# EAGLE design OSPLv2_4_12 (EAGLE 6.5.0)
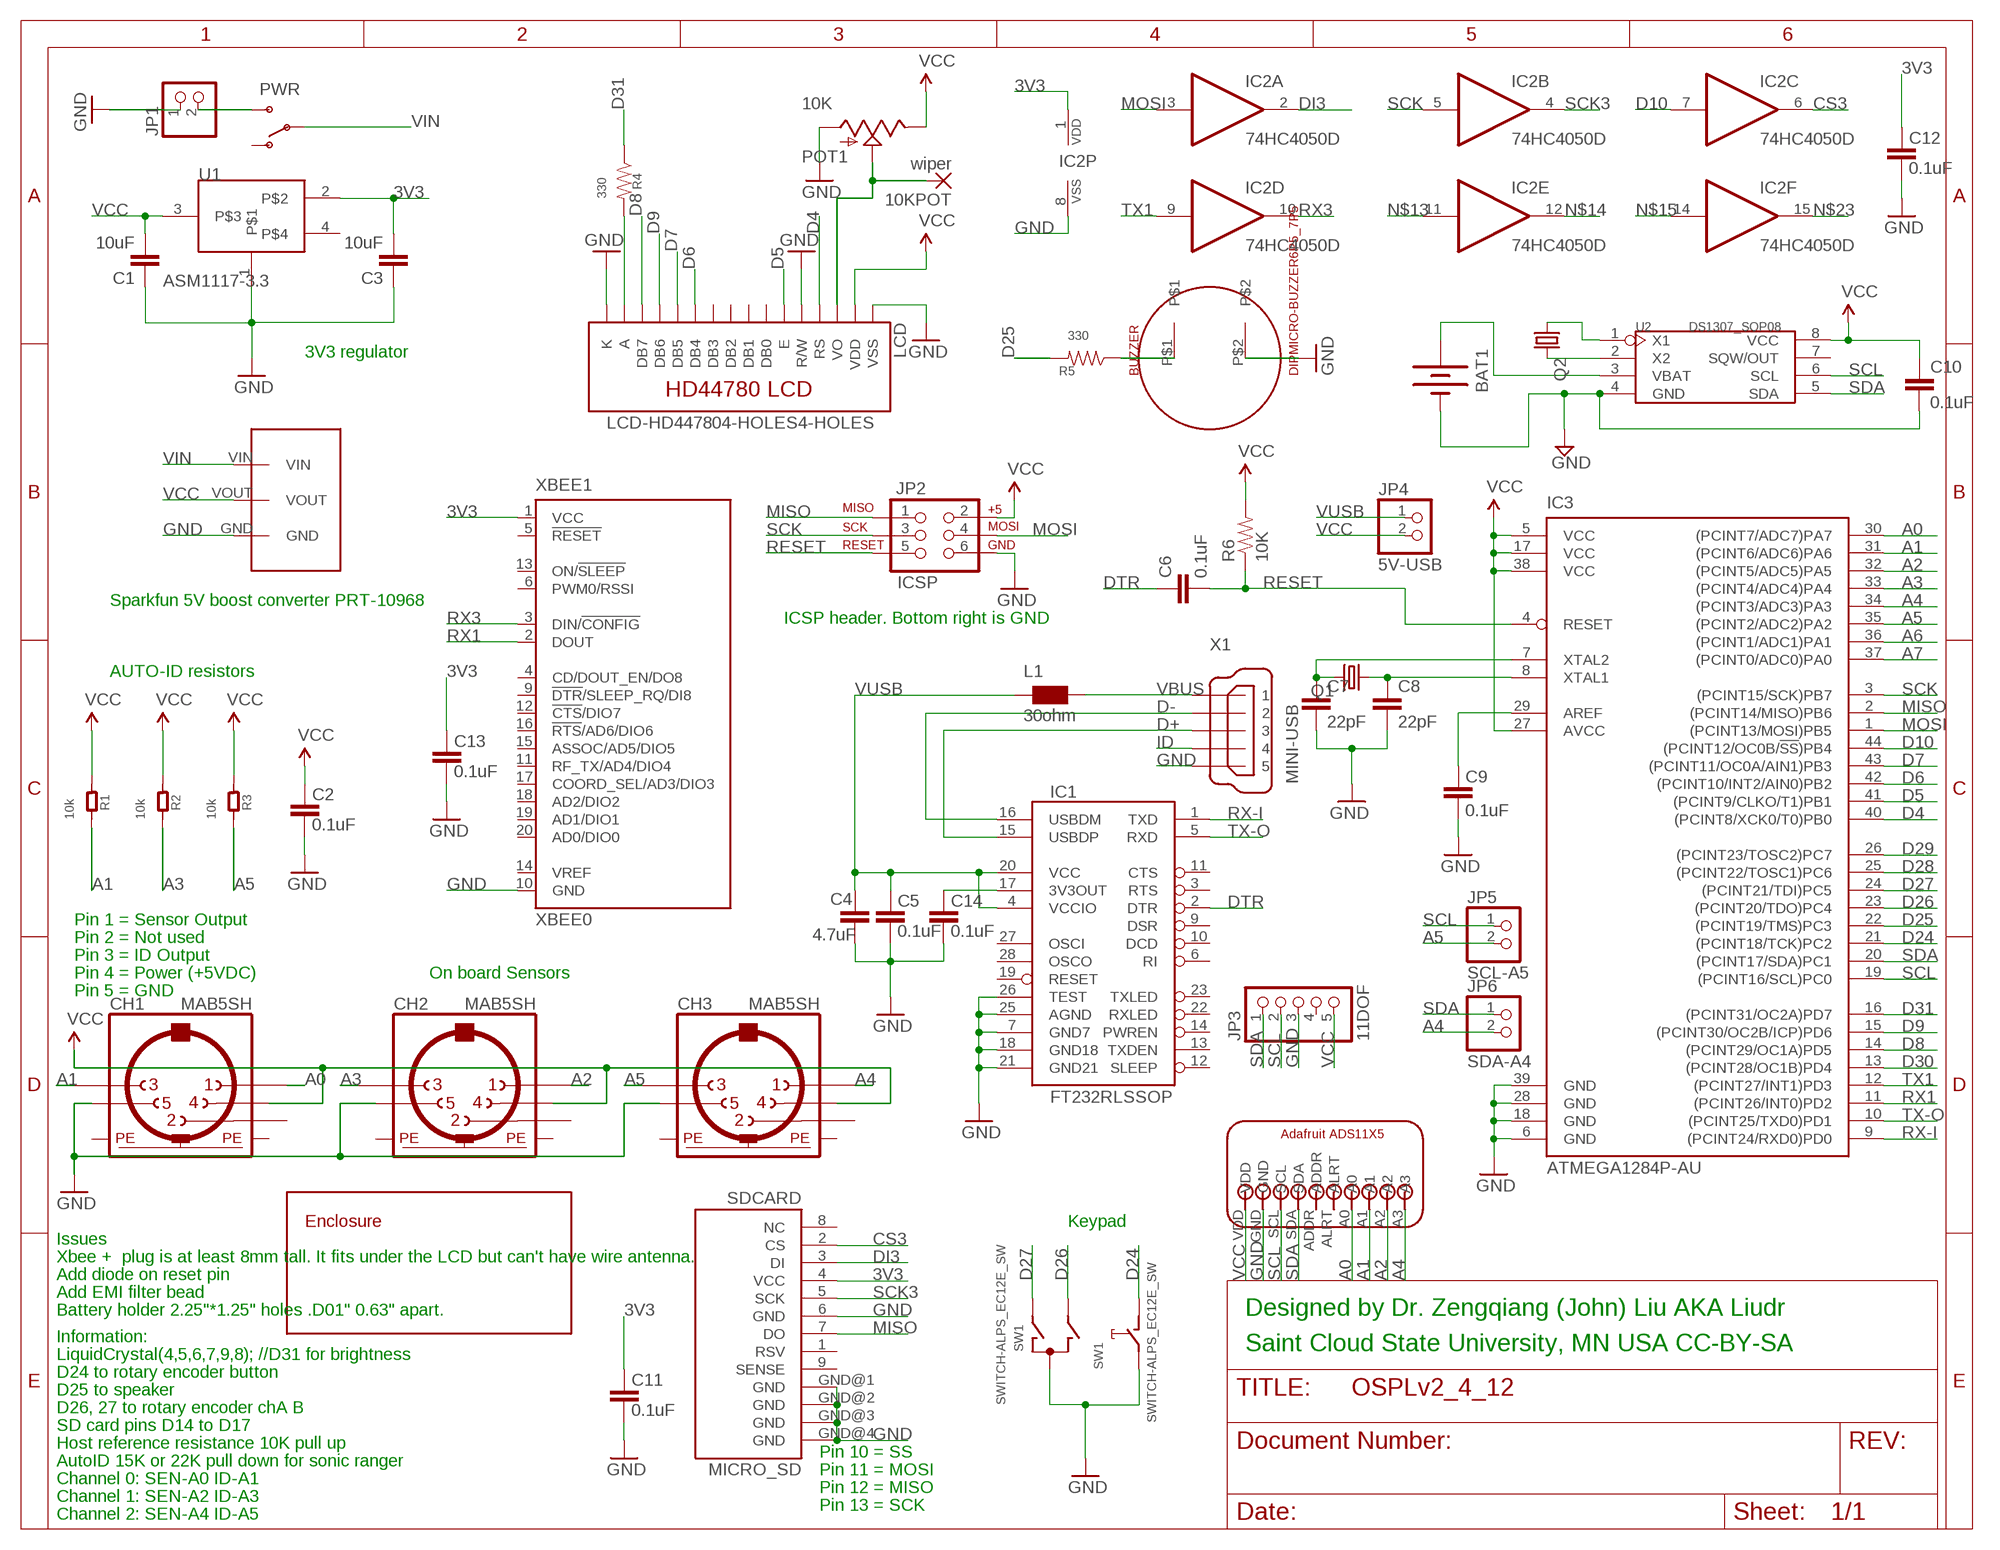
[diagram p0: schematic, sheet 1]

## Parts
10KPOT  wiper  1,6/0,9  [1,6/0,9]
BAT1  BATTERYHARWIN12MMHOLDER  [HARWIN12MMHOLDER]
BUZZER  DIPMICRO-BUZZER6P5_7P5  [BUZZER-6P5-7P5]
C1  10uF  CAP0603-CAP  [0603-CAP]
C2  0.1uF  CAP0603-CAP  [0603-CAP]
C3  10uF  CAP0603-CAP  [0603-CAP]
C4  4.7uF  CAP0603-CAP  [0603-CAP]
C5  0.1uF  CAP0603-CAP  [0603-CAP]
C6  0.1uF  CAP0603-CAP  [0603-CAP]
C7  22pF  CAP0603-CAP  [0603-CAP]
C8  22pF  CAP0603-CAP  [0603-CAP]
C9  0.1uF  CAP0603-CAP  [0603-CAP]
C10  0.1uF  CAP0603-CAP  [0603-CAP]
C11  0.1uF  CAP0603-CAP  [0603-CAP]
C12  0.1uF  CAP0603-CAP  [0603-CAP]
C13  0.1uF  CAP0603-CAP  [0603-CAP]
C14  0.1uF  CAP0603-CAP  [0603-CAP]
CH1  MAB5SH  [MAB5SH]
CH2  MAB5SH  [MAB5SH]
CH3  MAB5SH  [MAB5SH]
IC1  FT232RLSSOP  [SSOP28DB]
IC2  74HC4050D  4050D  [SO16]
IC3  ATMEGA1284P-AU  ATMEGA644A  [TQFP44]
JP1  PINHD-1X2SMALL-PADS  [1X02-BIG]
JP2  ICSP  AVR_SPI_PRG_6PTH  [2X3]
JP3  11DOF  PINHD-1X5  [1X05]
JP4  5V-USB  PINHD-1X2SMALL-PADS  [1X02-BIG]
JP5  SCL-A5  PINHD-1X2SMALL-PADS  [1X02-BIG]
JP6  SDA-A4  PINHD-1X2SMALL-PADS  [1X02-BIG]
L1  30ohm  WE-CBF_0805  [0805]
LCD  LCD-HD447804-HOLES4-HOLES  LCD-HD4478016X2-0-HOLES-NO-FRAME  [LCD-16X2-0HOLES-NO-FRAME]
POT1  10K  POT100K_3362U  [3362U]
PWR  SWITCH-SPSTPTH  [SWITCH-SPDT]
Q1  CRYSTALHC49UP  [HC49UP]
Q2  CRYSTALTC26H  [TC26H]
R1  10k  R-0603  [R0603]
R2  10k  R-0603  [R0603]
R3  10k  R-0603  [R0603]
R4  330  RESISTOR0603-RES  [0603-RES]
R5  330  RESISTOR0603-RES  [0603-RES]
R6  10K  RESISTOR0603-RES  [0603-RES]
SDCARD  MICRO_SD  MICROSD_PP  [MICROSD_PP]
SPEDC-DC  DC-DCBOOSTSPE-DC-DCBOOSTSPE-DC-DC-BOOST  [SPE-DC-DC-BOOST]
SW1  SWITCH-ALPS_EC12E_SW  [SWITCH-ALPS_ALPS_EC12E_SW]
U1  ASM1117-3.3  [SOT223]
U2  DS1307_SOP08  [SOP08]
U$1  ENCLOSUREAG-54  [BUSHING-AG-54]
U$2  ADAFRUIT-ADCADS11X5ADS11X5  [ADAFRUIT-ADC]
X1  MINI-USB  MINI-USB-32005-301  [32005-301]
XBEE1  XBEE0  XBEE-PRO  [XBEE-PRO]

## Nets
3V3 [power]: C3.2 C11.2 C12.2 C13.2 IC2.1(P:VDD) SDCARD.4(VCC) U1.2 XBEE1.1(VCC)
A0: CH1.1 IC3.30((PCINT7/ADC7)PA7) U$2.A0
A1: CH1.3 IC3.31((PCINT6/ADC6)PA6) R1.2 U$2.A1
A2: CH2.1 IC3.32((PCINT5/ADC5)PA5) U$2.A2
A3: CH2.3 IC3.33((PCINT4/ADC4)PA4) R2.2
A4: CH3.1 IC3.34((PCINT3/ADC3)PA3) JP6.2 U$2.A3
A5: CH3.3 IC3.35((PCINT2/ADC2)PA2) JP5.2 R3.2
A6: IC3.36((PCINT1/ADC1)PA1)
A7: IC3.37((PCINT0/ADC0)PA0)
AREF1: C9.2 IC3.29(AREF)
CS3: IC2.6(C:O) SDCARD.2(CS)
D4: IC3.40((PCINT8/XCK0/T0)PB0) LCD.RS
D5: IC3.41((PCINT9/CLKO/T1)PB1) LCD.E
D6: IC3.42((PCINT10/INT2/AIN0)PB2) LCD.DB4
D7: IC3.43((PCINT11/OC0A/AIN1)PB3) LCD.DB5
D8: IC3.14((PCINT29/OC1A)PD5) LCD.DB7
D9: IC3.15((PCINT30/OC2B/ICP)PD6) LCD.DB6
D10: IC2.7(C:I) IC3.44((PCINT12/OC0B/!SS!)PB4)
D24: IC3.21((PCINT18/TCK)PC2) SW1.D
D25: IC3.22((PCINT19/TMS)PC3) R5.2
D26: IC3.23((PCINT20/TDO)PC4) SW1.B
D27: IC3.24((PCINT21/TDI)PC5) SW1.A
D28: IC3.25((PCINT22/TOSC1)PC6)
D29: IC3.26((PCINT23/TOSC2)PC7)
D30: IC3.13((PCINT28/OC1B)PD4)
D31: IC3.16((PCINT31/OC2A)PD7) R4.1
D+: IC1.15(USBDP) X1.3
D-: IC1.16(USBDM) X1.2
DI3: IC2.2(A:O) SDCARD.3(DI)
DTR: C6.1 IC1.2(DTR)
GND [power]: BAT1.PADGND(-) BUZZER.P$2 C1.1 C2.1 C3.1 C4.2 C5.1 C7.2 C8.2 C9.1 C10.2 C11.1 C12.1 C13.1 C14.1 CH1.5 CH2.5 CH3.5 IC1.7(GND7) IC1.18(GND18) IC1.21(GND21) IC1.25(AGND) IC1.26(TEST) IC2.8(P:VSS) IC3.6(GND) IC3.18(GND) IC3.28(GND) IC3.39(GND) JP1.1 JP2.6 JP3.3 LCD.K LCD.R/W LCD.VSS POT1.P$3(A) SDCARD.6(GND) SDCARD.GND@1(GND) SDCARD.GND@2(GND) SDCARD.GND@3(GND) SDCARD.GND@4(GND) SPEDC-DC.GND SW1.C SW1.E U1.1 U2.4(GND) U$2.GND X1.5 XBEE1.10(GND)
ID: X1.4
MISO: IC3.2((PCINT14/MISO)PB6) JP2.1 SDCARD.7(DO)
MOSI: IC2.3(A:I) IC3.1((PCINT13/MOSI)PB5) JP2.4
N$1: C8.1 IC3.8(XTAL1) Q1.1
N$2: C7.1 IC3.7(XTAL2) Q1.2
N$3: Q2.1 U2.1(X1)
N$4: LCD.A R4.2
N$5 [power]: JP1.2 PWR.3(S)
N$6: BAT1.PAD3V3(+) U2.3(VBAT)
N$7: 10KPOT.1(P) LCD.VO POT1.P$2(S)
N$8: Q2.2 U2.2(X2)
N$9: C14.2 IC1.17(3V3OUT)
N$13: IC2.11(E:I)
N$14: IC2.12(E:O)
N$15: IC2.14(F:I)
N$23: IC2.15(F:O)
N$24: BUZZER.P$1 R5.1
RESET: C6.2 IC3.4(RESET) JP2.5 R6.1
RX1: IC3.11((PCINT26/INT0)PD2) XBEE1.2(DOUT)
RX3: IC2.10(D:O) XBEE1.3(DIN/!CONFIG)
RX-I: IC1.1(TXD) IC3.9((PCINT24/RXD0)PD0)
SCK: IC2.5(B:I) IC3.3((PCINT15/SCK)PB7) JP2.3
SCK3: IC2.4(B:O) SDCARD.5(SCK)
SCL: IC3.19((PCINT16/SCL)PC0) JP3.2 JP5.1 U2.6(SCL) U$2.SCL
SDA: IC3.20((PCINT17/SDA)PC1) JP3.1 JP6.1 U2.5(SDA) U$2.SDA
TX1: IC2.9(D:I) IC3.12((PCINT27/INT1)PD3)
TX-O: IC1.5(RXD) IC3.10((PCINT25/TXD0)PD1)
VBUS [power]: L1.2 X1.1
VCC [power]: C1.2 C2.2 C10.1 CH1.4 CH2.4 CH3.4 IC3.5(VCC) IC3.17(VCC) IC3.27(AVCC) IC3.38(VCC) JP2.2 JP3.5 JP4.2 LCD.VDD POT1.P$1(E) R1.1 R2.1 R3.1 R6.2 SPEDC-DC.VOUT U1.3 U2.8(VCC) U$2.VDD
VIN [power]: PWR.2(P) SPEDC-DC.VIN
VUSB [power]: C4.1 C5.2 IC1.4(VCCIO) IC1.20(VCC) JP4.1 L1.1
Unconnected: CH1.2 CH2.2 CH3.2 IC1.3(RTS) IC1.6(RI) IC1.9(DSR) IC1.10(DCD) IC1.11(CTS) IC1.12(SLEEP) IC1.13(TXDEN) IC1.14(PWREN) IC1.19(RESET) IC1.22(RXLED) IC1.23(TXLED) IC1.27(OSCI) IC1.28(OSCO) JP3.4 LCD.DB0 LCD.DB1 LCD.DB2 LCD.DB3 PWR.1(O) SDCARD.1(RSV) SDCARD.8(NC) SDCARD.9(SENSE) SW1.GND1(G) SW1.GND2(G) U1.4 U2.7(SQW/OUT) U$2.ADDR U$2.ALRT XBEE1.4(CD/DOUT_EN/DO8) XBEE1.5(!RESET) XBEE1.6(PWM0/RSSI) XBEE1.9(!DTR!/SLEEP_RQ/DI8) XBEE1.11(RF_TX/AD4/DIO4) XBEE1.12(!CTS!/DIO7) XBEE1.13(ON/!SLEEP) XBEE1.14(VREF) XBEE1.15(ASSOC/AD5/DIO5) XBEE1.16(!RTS!/AD6/DIO6) XBEE1.17(COORD_SEL/AD3/DIO3) XBEE1.18(AD2/DIO2) XBEE1.19(AD1/DIO1) XBEE1.20(AD0/DIO0)

## Notes on the sheet
- 3V3 regulator
- Sparkfun 5V boost converter PRT-10968
- ICSP header. Bottom right is GND
- AUTO-ID resistors
- Pin 1 = Sensor Output
- Pin 2 = Not used
- Pin 3 = ID Output
- Pin 4 = Power (+5VDC) | On board Sensors
- Pin 5 = GND
- Keypad
- Issues
- Xbee +  plug is at least 8mm tall. It fits under the LCD but can't have wire antenna.
- Add diode on reset pin
- Add EMI filter bead
- Battery holder 2.25"*1.25" holes .D01" 0.63" apart. | Designed by Dr. Zengqiang (John) Liu AKA Liudr
- Information:
- Saint Cloud State University, MN USA CC-BY-SA
- LiquidCrystal(4,5,6,7,9,8); //D31 for brightness
- D24 to rotary encoder button
- D25 to speaker
- D26, 27 to rotary encoder chA B
- SD card pins D14 to D17
- Host reference resistance 10K pull up
- Pin 10 = SS
- AutoID 15K or 22K pull down for sonic ranger
- Pin 11 = MOSI
- Channel 0: SEN-A0 ID-A1
- Pin 12 = MISO
- Channel 1: SEN-A2 ID-A3
- Pin 13 = SCK
- Channel 2: SEN-A4 ID-A5

## Power pins joined to a net without a drawn wire
PE: CH1.PE CH1.PE@(PE) CH2.PE CH2.PE@(PE) CH3.PE CH3.PE@(PE)

## Library data of the parts
10KPOT = wirepad:1,6/0,9: THROUGH-HOLE PAD
BAT1 = ICs:BATTERY: Battery Holders Various common sizes : AA, AAA, 20mm coin cell and 12mm coin cell.
BUZZER = ICs:DIPMICRO-BUZZER
C1-C14 = SparkFun:CAP: Capacitor Standard 0603 ceramic capacitor, and 0.1" leaded capacitor.
CH1-CH3 = con-hirschmann:MAB5SH: Female CONNECTOR 5 pins 90 deg. with shield, horizontal (DIN 41524); OC_FARNELL: 809883; OC_NEWARK: unknown
IC1 = SparkFun:FT232RL: USB UART FT232RL 4th Generation USB UART (USB <-> Serial) Controller. Spark Fun Electronics SKU : COM-00650
IC2 = 40xx:4050: Hex non-inverting BUFFER
IC3 = atmel:ATMEGA644: 8-bit Microcontroller with 64K Bytes In-System Programmable Flash Source: http://www.atmel.com/dyn/resources/prod_documents/doc2593.pdf; MPN: ATMEGA644PV-10AU; OC_FARNELL: 1455123; OC_NEWARK: 58M3748
JP1 JP4-JP6 = ICs:PINHD-1X2: PIN HEADER
JP2 = SparkFun:AVR_SPI_PRG_6: AVR ISP 6 Pin This is the reduced ISP connector for AVR programming. Common on Arduino. This footprint will take up less PCB space and can be used with a 10-pin to 6-pin adapter such as SKU: BOB-08508
JP3 = pinhead:PINHD-1X5: PIN HEADER
L1 = wuerth-elektronik:WE-CBF: SMD EMI Suppression Ferrite Beads - excellent anti-EMI properties - low DCR - impedances till 3000 ohms - rated current up to 6 A
LCD = ICs:LCD-HD44780
POT1 = SparkFun:POT
PWR = SparkFun:SWITCH-SPST: SPST Switch Simple slide switch. Spark Fun Electronics SKU : COM-00102
Q1 Q2 = crystal:CRYSTAL: CRYSTAL; OC_FARNELL: unknown; OC_NEWARK: unknown
R1-R3 = OPL Eagle Library:R*
R4-R6 = SparkFun:RESISTOR: Resistor Basic schematic elements and footprints for 0603, 1206, and PTH resistors.
SDCARD = DE1594-v2:MICROSD_PP
SPEDC-DC = ICs:DC-DCBOOST
SW1 = ICs:SWITCH-ALPS_EC12E_SW: ALPS rotary Encoder EC12E series with switch; MPN: EC12E2424407; OC_FARNELL: 1520813; OC_NEWARK: 74M1068
U1 = Itead_IC_110429:ASM1117-3.3: ICP006
U2 = Itead_IC_110429:DS1307: ICM002
U$1 = ICs:ENCLOSURE
U$2 = ICs:ADAFRUIT-ADC: This is the Adafruit ADS1105 or 1115 break out board
X1 = con-cypressindustries:MINI-USB-: MINI USB-B Conector Source: www.cypressindustries.com; OC_FARNELL: unknown; OC_NEWARK: unknown
XBEE1 = maxstream:XBEE: XBee (TM) /XBee-PRO(TM) OEM RF Modules Source: MaxStream, Inc. xbee_productmanual.pdf; MPN: XBP24-AWI-001; OC_FARNELL: 1337916; OC_NEWARK: 42M2667

## Net classes
0 default: width 0.254 mm, drill 0.305 mm, clearance 0.254 mm
1 power: width 0.356 mm

## Board
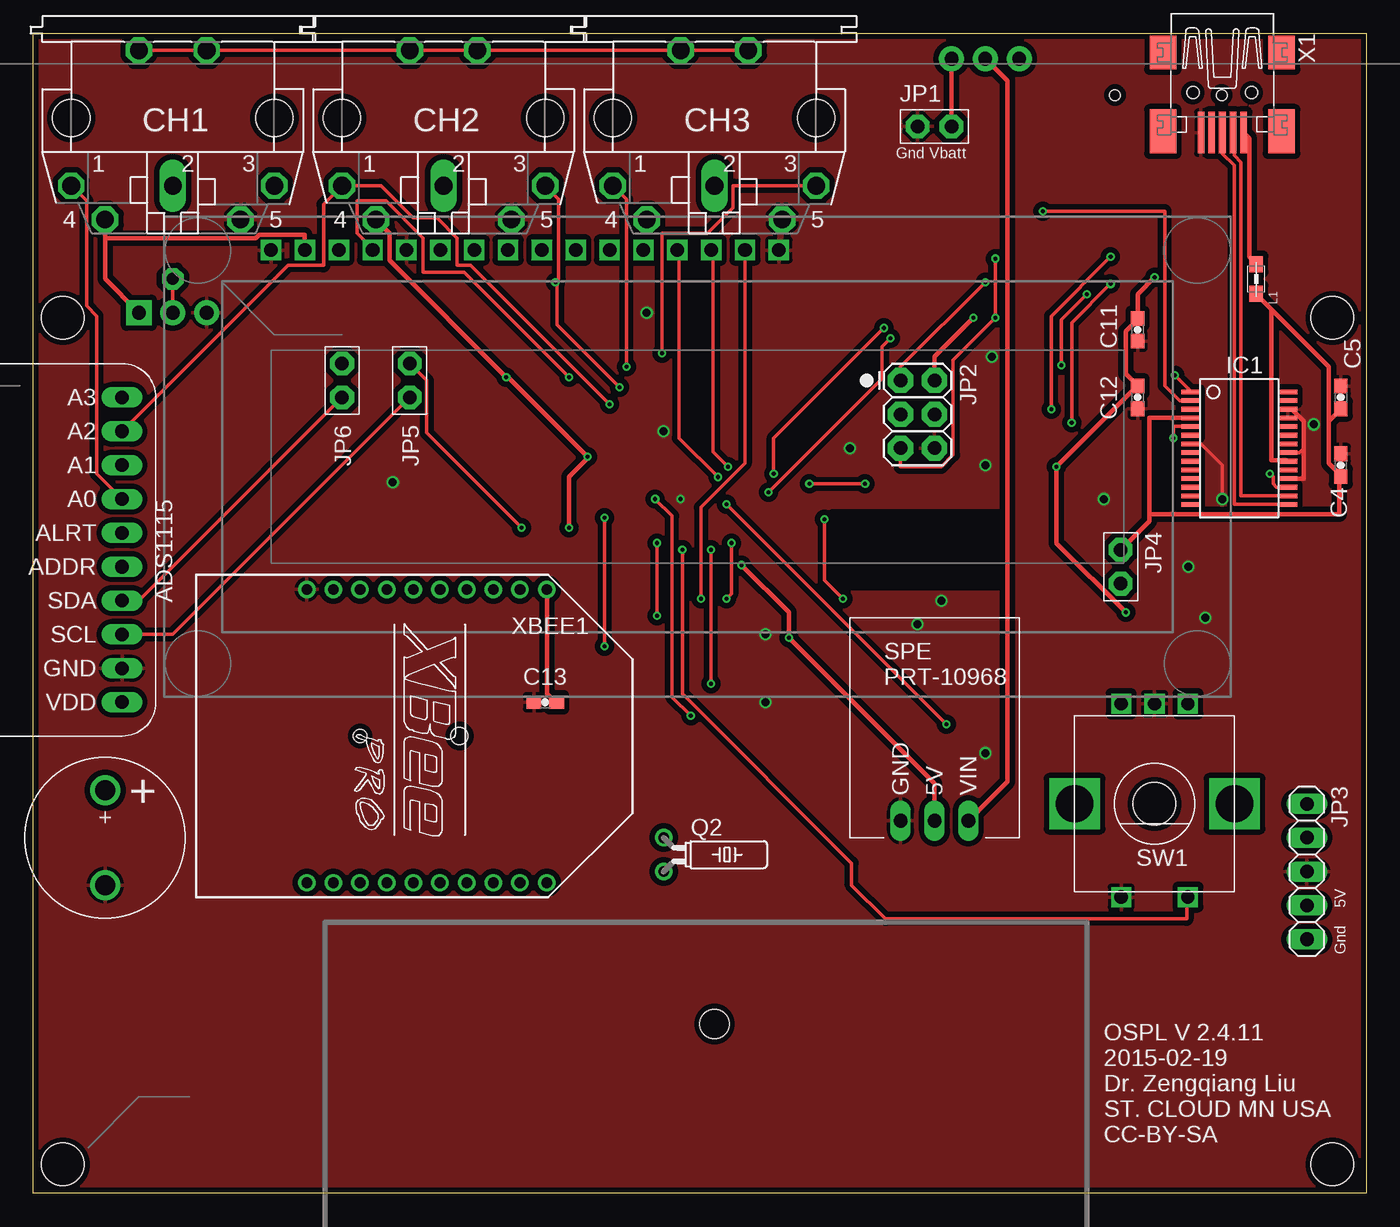
[diagram p1: board, top side]
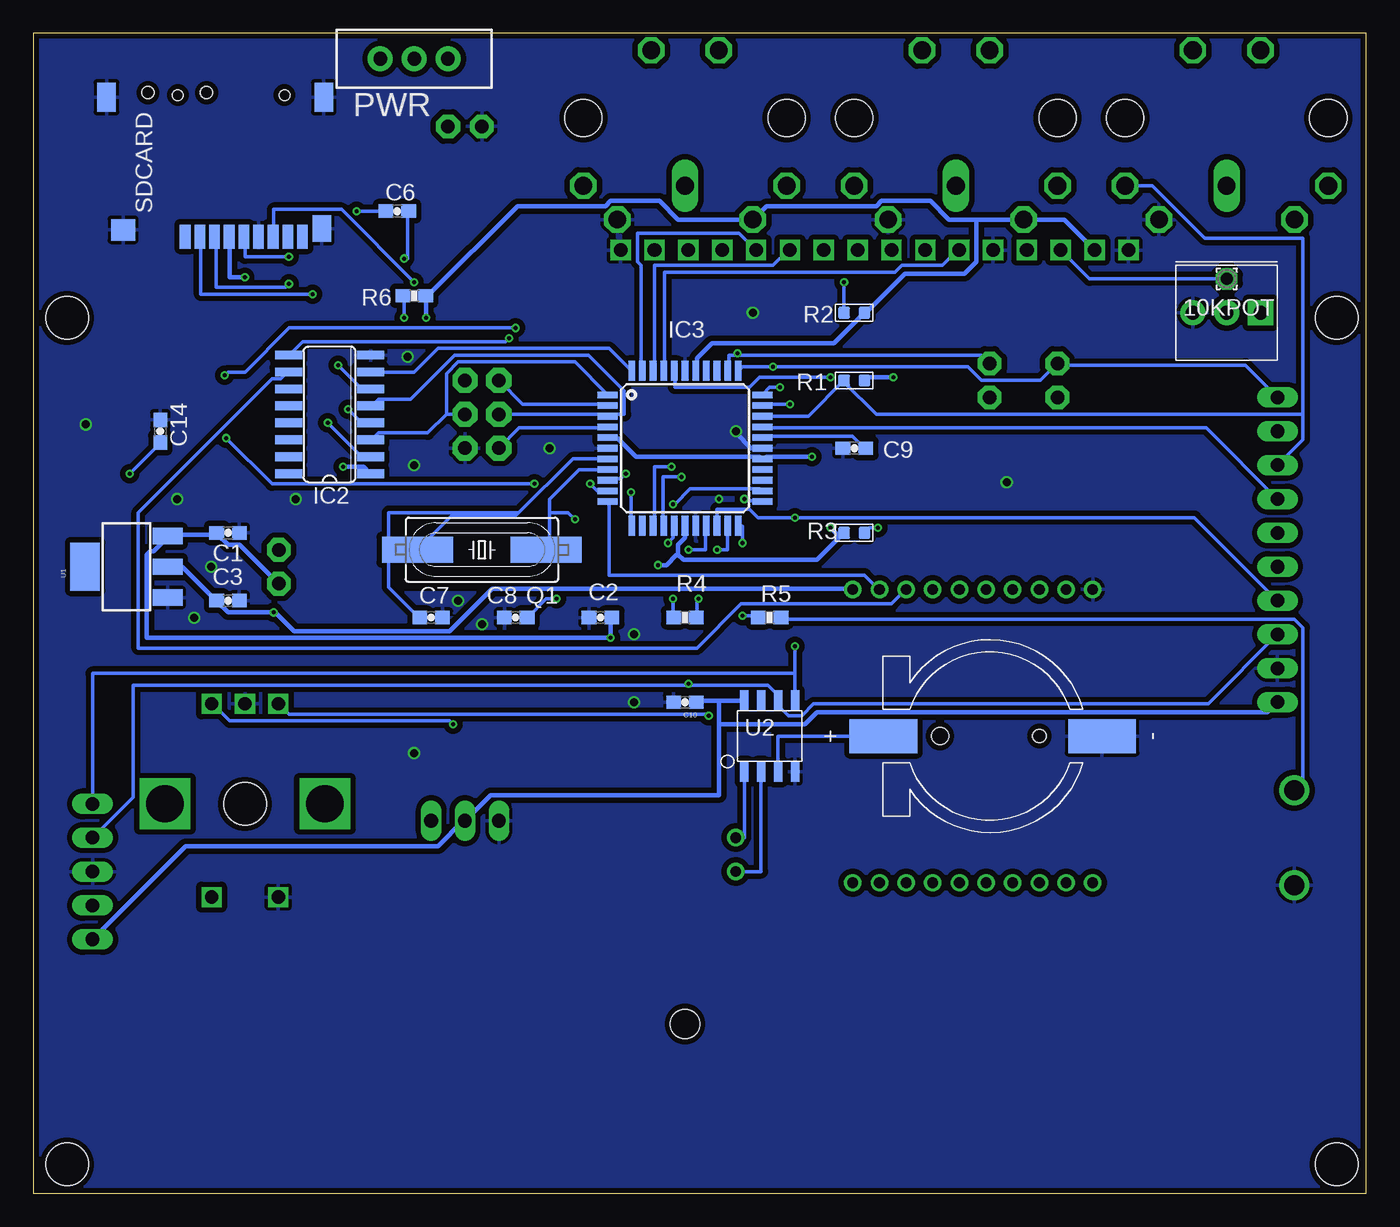
[diagram p2: board, bottom side, seen from below]

Size 100 x 87 mm. Coordinates in mm from the lower left corner, seen from the top.
Outline: 0,0 0,87 100,87 100,0 0,0
Copper layers (1*16): Top 0.035mm / dielectric 1.5mm / Bottom 0.035mm
Design rules "Fusion_eagle_rule_v1.1 *": minimum track width 6mil, minimum drill 12mil, track to track 6mil, track to pad 6mil, pad to pad 6mil, via to via 6mil, smd to smd 0mil, copper to edge 10mil, drill to drill 10mil, minimum pad ring 10mil, minimum via ring 6mil, stop-mask expansion 2mil, vias tented up to drill 100mil, thermal gap 10mil
Holes 3.2 mm at 84.12,29.21
Holes 2.2 mm at 51.1,12.7
tRestrict: area 60,45.7 to 72.7,50.8
bRestrict: area 60,45.7 to 72.7,50.8

### Footprints (pad centres in the part's own frame; a part is rotated, then mirrored left to right if it is on the bottom)
1,6/0,9 = drill 0.914 pad 1.6 octagon: 1 0,0
HARWIN12MMHOLDER = smd 2.54 x 5.08: PAD3V3 0,-7.975; PADGND 0,8.425 | hole 1: 0,3.725 | hole 1.3: 0,-3.725
BUZZER-6P5-7P5 = drill 1.5: P$1 0,3.55; P$2 0,-3.55
0603-CAP = smd 1.1 x 1: 1 -0.85,0; 2 0.85,0
MAB5SH = drill 1.321 octagon: 1 7.62,5.08; 3 -7.62,5.08; 4 5.08,7.62; 5 -5.08,7.62; PE -2.54,-5.08; PE@ 2.54,-5.08 | drill 1.321 long: 2 0,5.08 | hole 2.794: 7.62,0; -7.62,0
SSOP28DB = smd 0.348 x 1.397: 1 -4.225,-3.656; 2 -3.575,-3.656; 3 -2.925,-3.656; 4 -2.275,-3.656; 5 -1.625,-3.656; 6 -0.975,-3.656; 7 -0.325,-3.656; 8 0.325,-3.656; 9 0.975,-3.656; 10 1.625,-3.656; 11 2.275,-3.656; 12 2.925,-3.656; 13 3.575,-3.656; 14 4.225,-3.656; 15 4.225,3.656; 16 3.575,3.656; 17 2.925,3.656; 18 2.275,3.656; 19 1.625,3.656; 20 0.975,3.656; 21 0.325,3.656; 22 -0.325,3.656; 23 -0.975,3.656; 24 -1.625,3.656; 25 -2.275,3.656; 26 -2.925,3.656; 27 -3.575,3.656; 28 -4.225,3.656
SO16 = smd 0.66 x 2.032: 1 -4.445,-3.073; 2 -3.175,-3.073; 3 -1.905,-3.073; 4 -0.635,-3.073; 5 0.635,-3.073; 6 1.905,-3.073; 7 3.175,-3.073; 8 4.445,-3.073; 9 4.445,3.073; 10 3.175,3.073; 11 1.905,3.073; 12 0.635,3.073; 13 -0.635,3.073; 14 -1.905,3.073; 15 -3.175,3.073; 16 -4.445,3.073
TQFP44 = smd 1.5 x 0.5: 1 -5.8,4; 2 -5.8,3.2; 3 -5.8,2.4; 4 -5.8,1.6; 5 -5.8,0.8; 6 -5.8,0; 7 -5.8,-0.8; 8 -5.8,-1.6; 9 -5.8,-2.4; 10 -5.8,-3.2; 11 -5.8,-4; 23 5.8,-4; 24 5.8,-3.2; 25 5.8,-2.4; 26 5.8,-1.6; 27 5.8,-0.8; 28 5.8,0; 29 5.8,0.8; 30 5.8,1.6; 31 5.8,2.4; 32 5.8,3.2; 33 5.8,4 | smd 0.5 x 1.5: 12 -4,-5.8; 13 -3.2,-5.8; 14 -2.4,-5.8; 15 -1.6,-5.8; 16 -0.8,-5.8; 17 0,-5.8; 18 0.8,-5.8; 19 1.6,-5.8; 20 2.4,-5.8; 21 3.2,-5.8; 22 4,-5.8; 34 4,5.8; 35 3.2,5.8; 36 2.4,5.8; 37 1.6,5.8; 38 0.8,5.8; 39 0,5.8; 40 -0.8,5.8; 41 -1.6,5.8; 42 -2.4,5.8; 43 -3.2,5.8; 44 -4,5.8
1X02-BIG = drill 1.016 pad 1.778 octagon: 1 -1.27,0; 2 1.27,0
2X3 = drill 1.016 pad 1.88 octagon: 1 0,0; 2 0,2.54; 3 2.54,0; 4 2.54,2.54; 5 5.08,0; 6 5.08,2.54
1X05 = drill 1.016 long: 1 -5.08,0; 2 -2.54,0; 3 0,0; 4 2.54,0; 5 5.08,0
0805 = smd 1.2 x 1: 1 -1.1,0; 2 1.1,0
LCD-16X2-0HOLES-NO-FRAME = drill 1.016 square: A 3.56,15.5; DB0 -16.76,15.5; DB1 -14.22,15.5; DB2 -11.68,15.5; DB3 -9.14,15.5; DB4 -6.6,15.5; DB5 -4.06,15.5; DB6 -1.52,15.5; DB7 1.02,15.5; E -19.3,15.5; K 6.1,15.5; R/W -21.84,15.5; RS -24.38,15.5; VDD -29.46,15.5; VO -26.92,15.5; VSS -32,15.5
3362U = drill 1.016 pad 1.88 square: P$1 0,2.54 | drill 1.016 pad 1.88: P$2 2.54,2.54; P$3 5.08,2.54
SWITCH-SPDT = drill 1.016 pad 1.88: 1 0,2.54; 2 0,0; 3 0,-2.54
HC49UP = smd 5.334 x 1.93: 1 -4.826,0; 2 4.826,0
TC26H = drill 0.813: 1 -1.27,0; 2 1.27,0
R0603 = smd 0.889 x 0.889: 1 -0.762,0; 2 0.762,0
0603-RES = smd 1.1 x 1: 1 -0.85,0; 2 0.85,0
MICROSD_PP = smd 1.8 x 0.8: 1 0,3.85; 2 0,2.75; 3 0,1.65; 4 0,0.55; 5 0,-0.55; 6 0,-1.65; 7 0,-2.75; 8 0,-3.85; 9 0,-4.95 | smd 1.6 x 1.8: GND@1 0.5,8.5 | smd 2.2 x 1.4: GND@2 10.45,9.75; GND@4 10.45,-6.55 | smd 2 x 1.4: GND@3 0.6,-6.4 | hole 0.8: 10.6,4.4; 10.6,-3.6
SPE-DC-DC-BOOST = drill 1.016 long: GND -2.54,-6.35; VIN 2.54,-6.35; VOUT 0,-6.35
SWITCH-ALPS_ALPS_EC12E_SW = drill 1 square: A -2.5,-7.5; B 2.5,-7.5; C 0,-7.5; D -2.5,7; E 2.5,7 | drill 2.8 square: GND1 -6,0; GND2 6,0
SOT223 = smd 1.219 x 2.235: 1 -2.311,-3.099; 2 0,-3.099; 3 2.311,-3.099 | smd 3.6 x 2.2: 4 0,3.099
SOP08 = smd 0.635 x 1.524: 1 -1.905,-2.667; 2 -0.635,-2.667; 3 0.635,-2.667; 4 1.905,-2.667; 5 1.905,2.667; 6 0.635,2.667; 7 -0.635,2.667; 8 -1.905,2.667
BUSHING-AG-54 = hole 3.2: -47.625,-31.75; 47.625,-31.75; -47.625,31.75; 47.625,31.75
ADAFRUIT-ADC = drill 1.016 long: A0 3.81,0; A1 6.35,0; A2 8.89,0; A3 11.43,0; ADDR -1.27,0; ALRT 1.27,0; GND -8.89,0; SCL -6.35,0; SDA -3.81,0; VDD -11.43,0
32005-301 = smd 3.1 x 0.5: 1 3,1.6; 2 3,0.8; 3 3,0; 4 3,-0.8; 5 3,-1.6 | smd 2.5 x 2: M1 -3,-4.45; M2 -3,4.45 | smd 3.3 x 2: M3 2.9,4.45; M4 2.9,-4.45 | hole 0.9: 0,2.2; 0,-2.2
XBEE-PRO = drill 0.8 pad 1.27: 1 -11,9; 2 -11,7; 3 -11,5; 4 -11,3; 5 -11,1; 6 -11,-1; 7 -11,-3; 8 -11,-5; 9 -11,-7; 10 -11,-9; 11 11,-9; 12 11,-7; 13 11,-5; 14 11,-3; 15 11,-1; 16 11,1; 17 11,3; 18 11,5; 19 11,7; 20 11,9

### Placement (x,y rotation side)
10KPOT  10.46,68.58 180 bottom
BAT1  28.24,34.29 270 bottom
BUZZER  5.38,26.67 0 top
C1  85.39,49.53 180 bottom
C2  57.45,43.18 0 bottom
C3  85.39,44.45 180 bottom
C4  98.09,54.61 90 top
C5  98.09,59.69 270 top
C6  72.69,73.66 0 bottom
C7  70.15,43.18 0 bottom
C8  63.8,43.18 180 bottom
C9  38.4,55.88 0 bottom
C10  51.1,36.83 180 bottom
C11  82.85,64.77 90 top
C12  82.85,59.69 90 top
C13  38.4,36.83 0 top
C14  90.47,57.15 270 bottom
CH1  10.46,80.65 180 top
CH2  30.78,80.65 180 top
CH3  51.1,80.65 180 top
IC1  90.47,55.88 270 top
IC2  77.77,58.42 90 bottom
IC3  51.1,55.88 0 bottom
JP1  67.61,80.01 0 top
JP2  65.07,60.96 270 top
JP3  95.55,24.13 270 top
JP4  81.58,46.99 270 top
JP5  28.24,60.96 90 top
JP6  23.16,60.96 90 top
L1  91.74,68.58 90 top
LCD  49.83,55.25 0 top
POT1  7.92,68.58 180 bottom
PWR  71.42,85.09 90 bottom
Q1  66.34,48.26 180 bottom
Q2  47.29,25.4 270 top
R1  38.4,60.96 180 bottom
R2  38.4,66.04 180 bottom
R3  38.4,49.53 0 bottom
R4  51.1,43.18 0 bottom
R5  44.75,43.18 180 bottom
R6  71.42,67.31 0 bottom
SDCARD  84.76,71.75 90 bottom
SPEDC-DC  67.61,34.29 0 top
SW1  84.12,29.21 180 top
U1  93.01,46.99 90 bottom
U2  44.75,34.29 0 bottom
U$1  49.83,33.91 0 top
U$2  6.65,48.26 90 top
X1  89.2,82.55 270 top
XBEE1  29.51,34.29 270 top

### Tracks (layer width: path | path; a pad name or v marks a point on that pad's centre or on a via)
3V3  (via drill 0.3)
  Top 0.356: C13.2 39.17,36.83 38.53,37.47 38.53,45.21 XBEE1.1 | v84.12,68.71 82.85,67.44 C11.2 82.85,65.53 81.97,64.64 81.97,61.47 82.85,60.58 C12.2 82.73,60.45 v76.76,54.48 76.76,48.77 v81.97,43.56
  Bottom 0.356: U1.2 88.82,46.99 86.28,44.45 C3.2 86.16,44.32 85.39,43.56 v81.97,43.56 81.84,43.56 80.44,42.16 68.76,42.16 65.58,45.34 38.53,45.34 XBEE1.1 | v84.12,68.71 85.27,68.71 85.27,71.75 SDCARD.4 | v76.76,54.48 75.23,54.48 74.73,53.98 IC2.1
A0
  Top 0.254: CH1.1 3.99,74.42 3.99,66.55 4.75,65.79 4.75,53.98 U$2.A0
  Bottom 0.254: U$2.A0 11.99,57.4 45.26,57.4 IC3.30
A1
  Bottom 0.254: IC3.31 45.26,58.29 41.83,58.29 R1.2 39.17,60.83 36.75,58.42 4.75,58.42 | U$2.A1 4.75,56.52 4.75,58.42 | 4.75,58.42 4.75,71.63 12.12,71.63 16.05,75.56 CH1.3
A2  (via drill 0.3)
  Top 0.254: v43.23,59.18 32.82,69.6 31.8,69.6 31.8,71.63 30.28,73.15 28.5,73.15 26.09,75.56 CH2.1 21.77,74.17 21.77,69.6 19.1,69.6 U$2.A2
  Bottom 0.254: v43.23,59.18 45.26,59.18 IC3.32
A3  (via drill 0.3)
  Top 0.254: CH2.3 39.42,74.55 39.42,68.58 v39.17,68.33 39.29,68.33 39.29,65.15 v43.99,60.45
  Bottom 0.254: v39.17,68.33 R2.2 | v43.99,60.45 44.75,60.45 45.26,59.94 IC3.33
A4  (via drill 0.3)
  Top 0.254: CH3.1 44.5,74.55 v44.5,61.98
  Bottom 0.254: IC3.34 47.04,61.72 46.79,61.98 v44.5,61.98 29.9,61.98 28.88,60.96 24.43,60.96 JP6.2 23.16,62.1 9.07,62.1 U$2.A3
A5  (via drill 0.3)
  Top 0.254: v36.63,49.91 29.51,57.02 29.51,60.96 JP5.2 | CH3.3 52.5,75.56 52.5,73.91 50.6,72.01 47.17,72.01 v47.17,62.99
  Bottom 0.254: R3.2 37.26,49.91 v36.63,49.91 | 47.17,62.86 28.88,62.86 JP5.2 | 47.17,62.86 47.8,62.86 47.8,61.72 IC3.35 | 47.17,62.86 v47.17,62.99
AREF1
  Bottom 0.254: C9.2 37.64,55.88 38.53,56.77 45.26,56.77 IC3.29
CS3  (via drill 0.3)
  Top 0.254: v79.04,67.44 77.14,65.53 v77.14,62.1
  Bottom 0.254: v79.04,67.44 87.43,67.44 87.43,71.75 SDCARD.2 | v77.14,62.1 75.36,60.33 IC2.6
D4  (via drill 0.3)
  Top 0.254: v40.18,61.21 32.31,69.09 29.26,69.09 29.26,71.63 26.47,74.42 24.31,74.42 24.31,72.01 25.45,70.87 LCD.RS
  Bottom 0.254: v40.18,61.21 45.52,61.21 46.28,60.45 51.87,60.45 51.87,61.59 IC3.40
D5
  Bottom 0.254: IC3.41 52.63,61.72 52.63,69.09 35.36,69.09 34.85,69.6 31.8,69.6 30.66,70.74 LCD.E
D6
  Bottom 0.254: IC3.42 53.39,61.72 53.39,69.6 44.5,69.6 43.36,70.74 LCD.DB4
D7
  Bottom 0.254: IC3.43 54.41,61.72 54.41,69.6 54.66,69.85 54.66,72.01 47.04,72.01 45.9,70.87 LCD.DB5
D8  (via drill 0.3)
  Top 0.254: v52.12,54.48 50.98,55.63 50.98,70.74 LCD.DB7
  Bottom 0.254: v52.12,54.48 53.39,54.48 53.39,50.17 IC3.14
D9  (via drill 0.3)
  Top 0.254: v51.36,53.72 48.44,56.64 48.44,70.74 LCD.DB6
  Bottom 0.254: v51.36,53.72 52.76,53.72 52.76,50.17 IC3.15
D10
  Bottom 0.254: IC2.7 71.42,61.59 69.65,63.37 56.82,63.37 55.17,61.72 IC3.44
D24  (via drill 0.3)
  Top 0.254: v48.69,48.26 48.69,37.47 61.39,24.77 61.39,23.11 63.93,20.57 86.54,20.57 86.54,22.1 SW1.D
  Bottom 0.254: v48.69,48.26 47.93,48.26 47.93,50.04 IC3.21
D25  (via drill 0.3)
  Top 0.254: v46.79,48.77 v46.79,43.31
  Bottom 0.254: v46.79,43.31 45.77,43.31 45.64,43.18 R5.2 | v46.79,48.77 46.79,50.04 47.04,50.04 IC3.22
D26  (via drill 0.3)
  Top 0.254: v46.66,52.07 47.93,50.8 47.93,37.21 v49.33,35.81
  Bottom 0.254: v46.66,52.07 46.53,51.94 45.39,51.94 IC3.23 | v49.33,35.81 49.45,35.94 80.82,35.94 81.58,36.7 SW1.B
D27  (via drill 0.3)
  Top 0.254: v68.5,35.18 v51.99,51.69
  Bottom 0.254: v51.99,51.69 51.87,51.69 50.72,52.83 45.52,52.83 45.39,52.7 IC3.24 | v68.5,35.18 68.76,35.43 85.27,35.43 86.54,36.7 SW1.A
D31  (via drill 0.3)
  Top 0.254: v51.99,44.58 52.37,44.96 v52.37,48.77
  Bottom 0.254: v51.99,44.58 51.99,43.18 R4.1 | v52.37,48.77 51.99,49.15 51.99,50.04 IC3.16
D+
  Top 0.254: X1.3 89.2,77.98 90.09,77.09 90.09,51.69 94.03,51.69 IC1.15
D-
  Top 0.254: IC1.16 94.03,52.32 90.6,52.32 90.6,77.34 90.09,77.85 90.09,79.5 X1.2
DI3  (via drill 0.3)
  Top 0.254: v80.82,68.2 77.9,65.28 v77.9,57.78
  Bottom 0.254: v80.82,68.2 81.08,67.95 86.28,67.95 86.28,71.75 SDCARD.3 | v77.9,57.78 75.36,55.25 IC2.2
DTR  (via drill 0.3)
  Top 0.254: v75.74,73.66 84.89,73.66 84.89,60.58 86.03,59.44 86.79,59.44 IC1.2
  Bottom 0.254: v75.74,73.66 C6.1
GND  (via drill 0.3, 0.6)
  Top 0.254: IC1.7 87.61,56.2 89.2,54.61 v89.2,52.07 | IC1.21 94.98,55.56 95.3,55.88
  Top 0.356: 94.16,58.8 94.41,58.8 95.3,57.91 95.3,55.88 95.3,53.59 94.16,53.59 IC1.18 | 94.16,58.8 IC1.26 | 94.16,58.8 94.13,58.75
  Bottom 0.356: 45.39,55.88 IC3.28 46.15,55.88 47.29,57.02 v47.29,57.15 | 56.44,55.88 IC3.6 56.95,55.88
  other vias: 46.02,66.04 61.26,55.88 71.42,54.61 71.93,62.74 96.06,57.66 48.56,52.07 54.91,41.91 54.91,36.83 26.97,53.34 87.93,43.18 66.34,42.67 68.12,44.45 71.42,33.02 86.66,46.99 80.31,52.07
  pour Bottom (isolate 0.406): -2.24,-1.27 -2.24,88.9 103.57,88.9 103.57,-1.27
  pour Top (isolate 0.406): -0.97,90.17 101.9,90.17 101.9,-3.81 -0.97,-3.81
MISO  (via drill 0.3)
  Top 0.254: v71.42,68.33 65.07,61.98 JP2.1
  Bottom 0.254: JP2.1 63.3,59.18 56.95,59.18 IC3.2 | v71.42,68.33 76.89,73.79 81.97,73.79 81.97,71.75 SDCARD.7
MOSI
  Bottom 0.254: 69.01,58.42 69.01,61.47 68.12,62.36 59.36,62.36 56.95,59.94 IC3.1 | JP2.4 69.01,58.42 | 69.01,58.42 70.41,57.02 74.09,57.02 74.6,56.52 IC2.3
N$1  (via drill 0.3)
  Top 0.254: v60.76,44.58 59.36,45.97 v59.36,50.55
  Bottom 0.254: IC3.8 59.05,54.28 61.26,52.07 61.26,51.05 | 61.26,51.05 61.26,48.51 Q1.1 | v60.76,44.58 61.52,44.58 62.92,43.18 C8.1 | v59.36,50.55 59.87,51.05 61.26,51.05
N$2
  Bottom 0.254: IC3.7 59.52,55.08 63.61,50.99 | 63.61,50.99 63.8,50.8 68.63,50.8 Q1.2 | C7.1 71.04,43.18 73.33,45.47 73.33,51.05 63.68,51.05 63.61,50.99
N$3
  Bottom 0.254: U2.1 46.66,26.67 Q2.1
N$4  (via drill 0.3)
  Top 0.254: v50.09,44.58 50.09,51.44 53.39,54.74 LCD.A
  Bottom 0.254: v50.09,44.58 50.22,44.58 50.22,43.18 R4.2
N$5
  Top 0.356: PWR.3 JP1.2
N$6
  Bottom 0.254: U2.3 44.12,34.29 BAT1.PAD3V3
N$7
  Top 0.254: 10KPOT.1 POT1.P$2
  Bottom 0.254: 10KPOT.1 20.75,68.58 LCD.VO
N$8
  Bottom 0.254: U2.2 45.39,24.13 Q2.2
N$9  (via drill 0.3)
  Top 0.254: v92.76,53.98 93.01,53.72 93.01,53.21 93.27,52.96 94.03,52.96 IC1.17
  Bottom 0.254: v92.76,53.98 90.47,56.26 C14.2
N$24
  Bottom 0.254: R5.1 43.87,43.18 43.74,43.05 5.38,43.05 4.75,42.42 4.75,30.23 BUZZER.P$1
PE
  Top 0.254: CH3.PE CH3.PE@ CH2.PE CH2.PE@ CH1.PE CH1.PE@
RESET  (via drill 0.3)
  Top 0.254: JP2.5 65.07,54.48 68.12,54.48 69.01,55.37 69.01,62.48 v72.19,65.66 v72.19,70.1
  Bottom 0.254: v72.19,65.66 72.19,67.31 R6.1 | JP2.5 63.55,57.4 56.95,57.4 IC3.4 | v72.19,70.1 71.93,70.1 71.93,73.66 C6.2
RX1
  Bottom 0.254: IC3.11 56.82,51.82 56.82,46.36 37.64,46.36 36.63,45.34 XBEE1.2
RX3
  Bottom 0.254: IC2.10 80.95,61.59 81.46,61.09 82.09,61.09 92.13,51.05 92.13,40.89 50.22,40.89 46.91,44.2 35.61,44.2 34.59,45.21 XBEE1.3
RX-I  (via drill 0.3)
  Top 0.254: v85.65,61.34 86.79,60.2 IC1.1 | v63.8,64.9 55.55,56.64 v55.55,53.98
  Bottom 0.254: v85.65,61.34 85.39,61.59 84.12,61.59 80.82,64.9 v63.8,64.9 | v55.55,53.98 55.93,53.59 56.82,53.59 IC3.9
SCK
  Bottom 0.254: JP2.3 57.07,58.42 56.95,58.29 IC3.3 56.95,58.42 55.68,58.42 55.68,60.2 58.34,62.86 68.38,62.86 71.68,59.56 74.09,59.56 74.6,59.06 IC2.5
SCK3  (via drill 0.3)
  Top 0.254: v80.82,70.23 76.38,65.79 v76.38,58.8
  Bottom 0.254: v80.82,70.23 84.12,70.23 84.12,71.75 SDCARD.5 | v76.38,58.8 75.36,57.78 IC2.4
SCL  (via drill 0.3)
  Top 0.254: v50.85,38.23 v50.85,48.26 | JP5.1 10.46,41.91 U$2.SCL
  Bottom 0.254: v50.85,48.26 49.58,48.26 49.58,50.04 IC3.19 | JP3.2 92.51,29.72 92.51,38.1 50.85,38.1 v50.85,38.23 50.72,38.1 44.88,38.1 44.12,37.34 U2.6 44.12,36.58 43.36,35.81 42.34,35.81 41.45,36.7 11.86,36.7 U$2.SCL
SDA  (via drill 0.3)
  Top 0.254: v42.85,50.67 v42.85,41.02 | JP6.1 7.92,44.45 U$2.SDA
  Bottom 0.254: U$2.SDA 12.88,50.67 v42.85,50.67 45.64,50.67 46.28,51.31 48.69,51.31 48.69,50.17 IC3.20 | v42.85,41.02 42.85,38.99 | 42.85,38.99 U2.5 | JP3.1 95.55,38.99 42.85,38.99
TX1  (via drill 0.3)
  Top 0.254: v55.17,52.58 63.68,61.09 63.68,63.5 v64.31,64.14
  Bottom 0.254: v55.17,52.58 55.17,50.17 IC3.12 | v64.31,64.14 64.57,63.88 79.81,63.88 80.82,62.86 IC2.9
TX-O  (via drill 0.3)
  Top 0.254: v85.52,56.64 85.52,57.53 86.79,57.53 IC1.5 | v58.22,53.21 v62.41,53.21
  Bottom 0.254: v85.52,56.64 82.09,53.21 v62.41,53.21 | v58.22,53.21 57.71,52.7 56.95,52.7 IC3.10
VBUS
  Top 0.356: L1.2 91.74,69.72 91.24,70.23 91.24,79.12 90.86,79.5 X1.1
VCC  (via drill 0.3)
  Top 0.356: POT1.P$1 5.38,68.58 5.38,71.63 | CH1.4 5.38,71.63 | v70.54,65.66 67.61,62.74 JP2.2 | CH2.4 26.72,72.01 26.72,69.98 v35.48,61.21 35.61,61.21 v41.58,55.25 41.58,55.12 40.18,53.72 v40.18,49.91 | 5.38,71.63 16.69,71.63 16.94,71.88 20.37,71.88 20.37,70.87 LCD.VDD | SPEDC-DC.VOUT 67.61,30.73 v56.69,41.66 56.69,43.56 v53.14,47.12
  Bottom 0.356: 50.34,61.72 IC3.38 50.22,61.72 50.22,62.61 49.07,63.75 39.93,63.75 R2.1 37.52,66.04 34.59,68.96 30.15,68.96 29.26,69.85 29.26,73.03 | 56.95,56.64 IC3.5 56.82,56.64 56.18,56.64 54.79,55.25 45.52,55.25 45.39,55.12 IC3.27 45.14,55.12 45.01,55.25 v41.58,55.25 | v70.54,65.66 70.54,67.31 R6.2 70.41,67.31 63.68,74.04 57.07,74.04 56.69,74.42 53.01,74.42 51.61,73.03 CH3.4 45.01,74.04 36.75,74.04 36.37,74.42 32.69,74.42 31.29,73.03 29.26,73.03 | R1.1 37.39,61.21 v35.48,61.21 | LCD.VDD 20.5,70.87 22.66,73.03 CH2.4 29.26,73.03 | 51.61,47.88 51.23,47.5 41.2,47.5 R3.1 39.55,49.28 v40.18,49.91 | 51.61,47.88 51.61,48.64 51.1,49.15 IC3.17 | U2.8 48.56,36.96 | 48.56,36.96 50.09,36.96 50.22,36.83 C10.1 | C2.2 56.69,43.18 v56.69,41.66 91.49,41.66 91.49,47.88 91.24,48.13 90.98,48.13 89.97,49.15 U1.3 89.84,49.4 86.41,49.4 86.28,49.53 C1.2 86.16,49.4 85.39,48.64 84.51,48.64 JP4.2 | 48.56,35.18 48.56,29.85 65.71,29.85 SPEDC-DC.VOUT 67.74,27.94 69.65,26.04 88.57,26.04 JP3.5 | 48.56,35.18 48.56,36.96 | U$2.VDD 7.42,36.07 41.2,36.07 42.09,35.18 48.56,35.18 | v53.14,47.12 52.5,47.12 51.74,47.88 51.61,47.88
VIN
  Top 0.356: SPEDC-DC.VIN 73.08,30.86 73.08,83.44 PWR.2
VUSB
  Top 0.356: 83.74,50.93 83.74,50.42 JP4.1 | 83.74,50.93 83.74,58.17 86.79,58.17 IC1.4 | 97.21,57.91 97.21,54.74 98.09,53.85 C4.1 97.97,53.72 97.97,50.93 83.74,50.93 | 97.21,57.91 98.09,58.8 C5.2 | 92.95,66.23 97.21,61.98 97.21,57.91 | 92.95,66.23 91.74,67.44 L1.1 | IC1.20 94.03,54.99 92.89,54.99 92.89,66.17 92.95,66.23

### Text on the board
tPlace: Gnd Vbatt | ADS1115 | + | Gnd 5V | OSPL V 2.4.11 / 2015-02-19 / Dr. Zengqiang Liu / ST. CLOUD MN USA / CC-BY-SA